# EAGLE design Board_2_sensor_v1 (EAGLE 7.1.0)
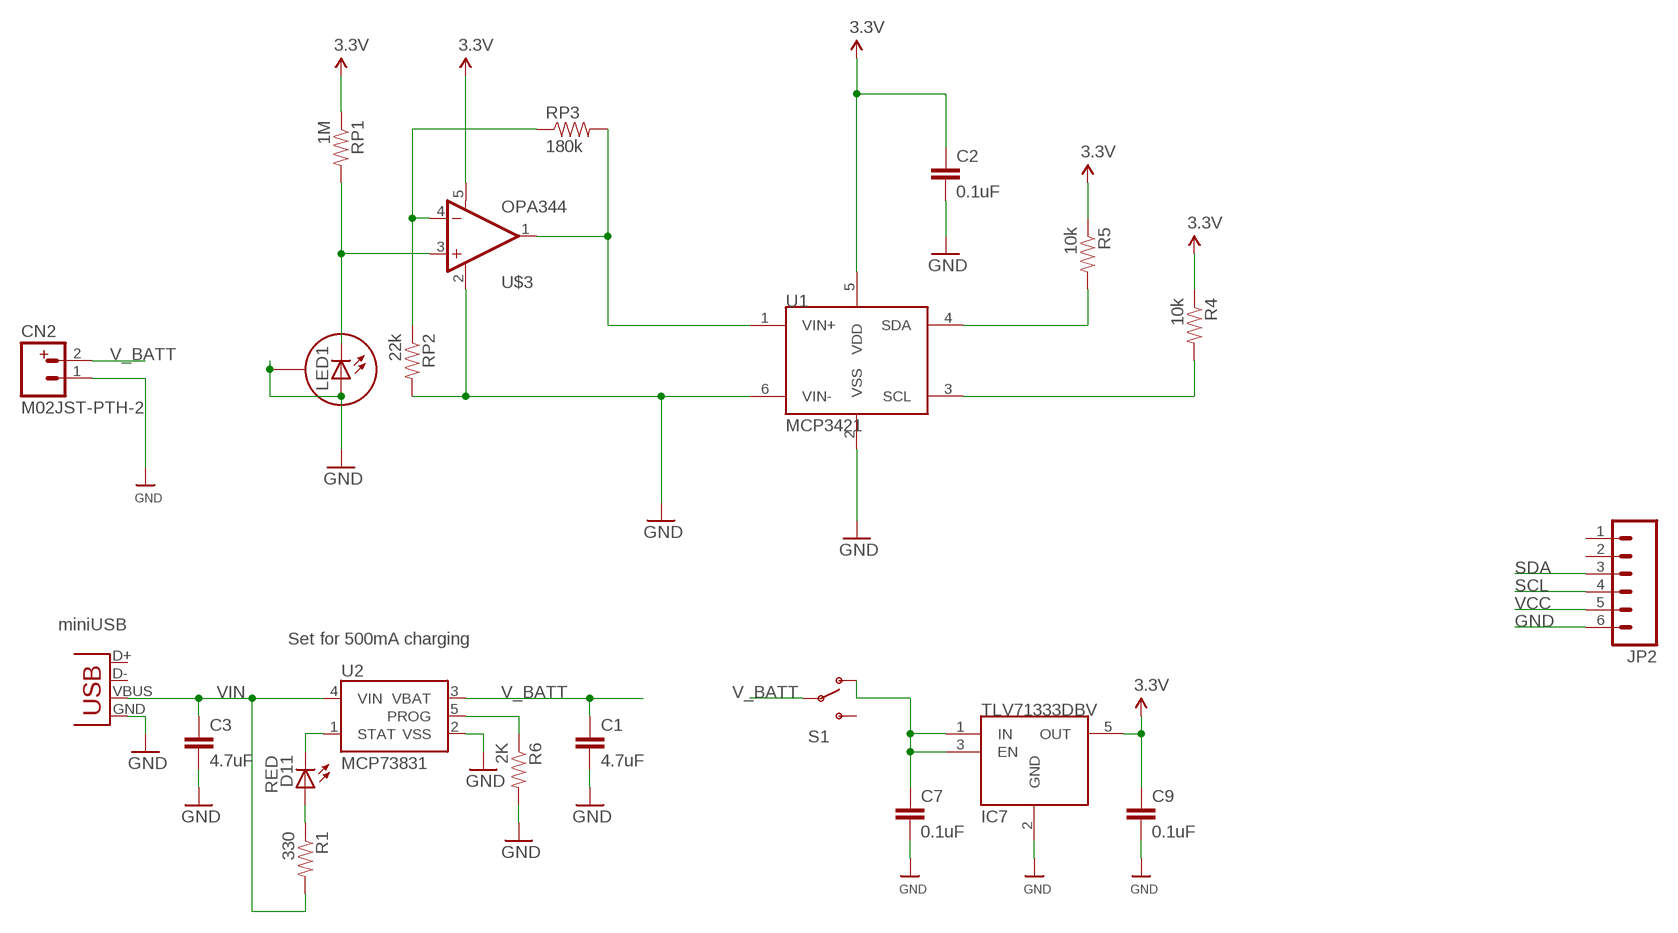
[diagram p0: schematic, sheet 1]

## Parts
C1  4.7uF  CAP0402-CAP  [0402-CAP]
C2  0.1uF  CAP0402-CAP  [0402-CAP]
C3  4.7uF  CAP0402-CAP  [0402-CAP]
C7  0.1uF  C-EUC0402  [C0402]
C9  0.1uF  C-EUC0402  [C0402]
CN2  M02JST-PTH-2  [JST-2-PTH]
D11  RED  LED0603  [LED-0603]
IC7  TLV71333DBV  [SOT-23-5]
JP2  M06SMD-1MM  [1X06-1MM]
LED1  MTPD1346  [TO-46]
R1  330  RESISTOR0402-RES  [0402-RES]
R4  10k  RESISTOR0402-RES  [0402-RES]
R5  10k  RESISTOR0402-RES  [0402-RES]
R6  2K  RESISTOR0402-RES  [0402-RES]
RP1  1M  RESISTOR0402-RES  [0402-RES]
RP2  22k  RESISTOR0402-RES  [0402-RES]
RP3  180k  RESISTOR0402-RES  [0402-RES]
S1  SWITCH-SPDTSMD  [AYZ0202]
U1  MCP3421  [SOT-23-6]
U2  MCP73831  [SOT23-5]
U$3  OPA344  [SOT23-5]
X1  Micro USB  USB-MICROB  [USB-MICROB]

## Nets
GND: C1.2 C2.2 C3.2 C7.2 C9.2 CN2.1 IC7.2(GND) JP2.6 LED1.C LED1.CASE R6.2 RP2.2 U1.2(VSS) U1.6(VIN-) U2.2(VSS) U$3.2(V-) X1.GND
N$2: LED1.A RP1.2 U$3.3(+IN)
N$3: RP2.1 RP3.1 U$3.4(-IN)
N$4: RP3.2 U1.1(VIN+) U$3.1(OUT)
N$6: C7.1 IC7.1(IN) IC7.3(EN) S1.1(O)
N$13: D11.A R1.1
PROG: R6.1 U2.5(PROG)
SCL: JP2.4 R4.2 U1.3(SCL)
SDA: JP2.3 R5.2 U1.4(SDA)
STAT: D11.C U2.1(STAT)
V_BATT: C1.1 CN2.2 S1.2(P) U2.3(VBAT)
VCC: C2.1 C9.1 IC7.5(OUT) JP2.5 R4.1 R5.1 RP1.1 U1.5(VDD) U$3.5(V+) ; supply symbol labelled 3.3V
VIN: C3.1 R1.2 U2.4(VIN) X1.VBUS
Unconnected: JP2.1 JP2.2 S1.3(S) X1.D+ X1.D-

## Notes on the sheet
- miniUSB
- Set for 500mA charging

## Library data of the parts
C1-C3 = SparkFun:CAP: Capacitor Standard 0603 ceramic capacitor, and 0.1" leaded capacitor.
C7 C9 = rcl:C-EU: CAPACITOR, European symbol
CN2 = SparkFun-Connectors:M02: Standard 2-pin 0.1" header. Use with - straight break away headers ( PRT-00116) - right angle break away headers (PRT-00553) - swiss pins (PRT-00743) - machine pins (PRT-00117) - female headers (PRT-00115) Molex polarized connector foot print use with: PRT-08233 with associated crimp pins and housings. 2.54_SCREWTERM for use with PRT-10571. 3.5mm Screw Terminal footprints for PRT-08084 5mm Screw Terminal footprints for use with PRT-08433
D11 = SparkFun:LED: LEDs Standard schematic elements and footprints for 5mm, 3mm, 1206, and 0603 sized LEDs. 5mm - Spark Fun Electronics SKU : COM-00529 (and others)
IC7 = anoven:TLV713: Capacitor-Free, 150-mA, Low-Dropout Regulator with Foldback Current Limit for Portable Devices
JP2 = SparkFun-Connectors:M06: Header 6 Standard 6-pin 0.1" header. Use with straight break away headers (SKU : PRT-00116), right angle break away headers (PRT-00553), swiss pins (PRT-00743), machine pins (PRT-00117), and female headers (PRT-00115). Molex polarized connector foot print use with SKU : PRT-08094 with associated crimp pins and housings. NOTES ON THE VARIANTS LOCK and LOCK_LONGPADS... This footprint was designed to help hold the alignment of a through-hole component (i.e. 6-pin header) while soldering it into place. You may notice that each hole has been shifted either up or down by 0.005 of an inch from it's more standard position (which is a perfectly straight line). This slight alteration caused the pins (the squares in the middle) to touch the edges of the holes. Because they are alternating, it causes a "brace" to hold the component in place. 0.005 has proven to be the perfect amount of "off-center" position when using our standard breakaway headers. Although looks a little odd when you look at the bare footprint, once you have a header in there, the alteration is very hard to notice. Also,if you push a header all the way into place, it is covered up entirely on the bottom side. This idea of altering the position of holes to aid alignment will be further integrated into the Sparkfun Library for other footprints. It can help hold any component with 3 or more connection pins.
LED1 = IdleHandsProject:MTPD1346: LEDs Standard schematic elements and footprints for 5mm, 3mm, 1206, and 0603 sized LEDs. 5mm - Spark Fun Electronics SKU : COM-00529 (and others)
R1 R4-R6 RP1-RP3 = SparkFun:RESISTOR: Resistor Basic schematic elements and footprints for 0603, 1206, and PTH resistors.
S1 = SparkFun-Electromechanical:SWITCH-SPDT: SPDT Switch Simple slide switch, Spark Fun Electronics SKU : COM-00102 DPDT SMT slide switch, AYZ0202, SWCH-08179; PROD_ID: SWCH-08179
U1 = IdleHandsProject:MCP3421: 18-Bit Analog-to-Digital Converter with I2 C Interface and On-Board Reference http://ww1.microchip.com/downloads/en/DeviceDoc/22003e.pdf http://www.digikey.ca/product-detail/en/MCP3421A0T-E%2FCH/MCP3421A0T-E%2FCHCT-ND/2183406
U2 = SparkFun:MCP73831: Microchip's MCP73831 Miniature single cell, fully integrated Li-Ion, Li-polymer charge management controller http://ww1.microchip.com/downloads/en/DeviceDoc/21984a.pdf
U$3 = SparkFun-AnalogIC:OPA344: Single gate rail-to-rail output op-amp. Inputs extend 300mV past rails.
X1 = SparkFun:USB: USB Connectors USB-B-PTH is fully proven SKU : PRT-00139 USB-miniB is fully proven SKU : PRT-00587 USB-A-PCB is untested. USB-A-H is throughly reviewed, but untested. Spark Fun Electronics SKU : PRT-00437 USB-B-SMT is throughly reviewed, but untested. Needs silkscreen touching up. USB-A-S has not been used/tested USB-MB-H has not been used/tested

## Net classes
1 vcc: width 0.254 mm

## Board
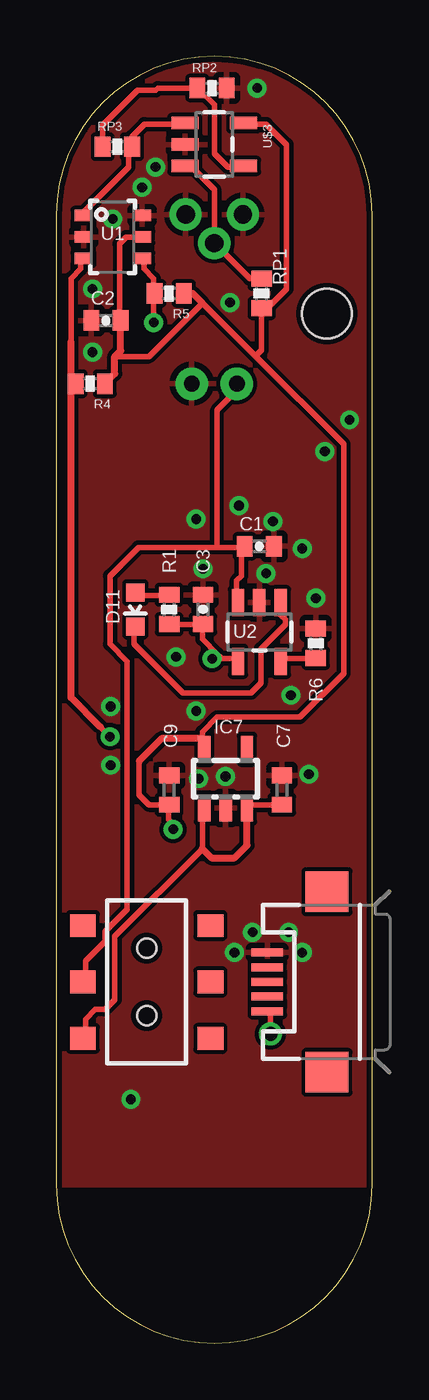
[diagram p1: board, top side]
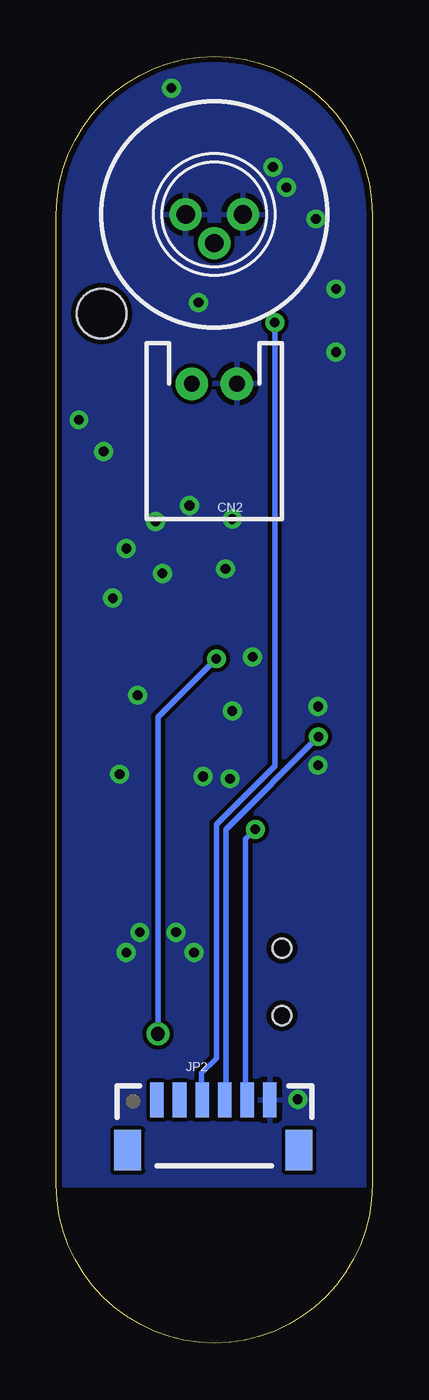
[diagram p2: board, bottom side, seen from below]

Size 14 x 57 mm. Coordinates in mm from the lower left corner, seen from the top.
Outline: 0,7 arc180 14,7 14,50 arc180 0,50 0,7
Copper layers (1*16): Top 0.035mm / dielectric 1.5mm / Bottom 0.035mm
Design rules "default *": minimum track width 10mil, minimum drill 17mil, track to track 7mil, track to pad 7mil, pad to pad 7mil, via to via 7mil, smd to smd 7mil, copper to edge 10mil, drill to drill 8mil, minimum pad ring 10mil, minimum via ring 8mil, stop-mask expansion 4mil, vias tented up to drill 0mil, thermal gap 10mil
Holes 2.2 mm at 12,45.6

### Footprints (pad centres in the part's own frame; a part is rotated, then mirrored left to right if it is on the bottom)
0402-CAP = smd 0.7 x 0.9: 1 -0.65,0; 2 0.65,0
C0402 = smd 0.7 x 0.9: 1 -0.65,0; 2 0.65,0
JST-2-PTH = drill 0.7 pad 1.448: 1 -1,0; 2 1,0
LED-0603 = smd 0.8 x 0.8: A 0,-0.75; C 0,0.75
SOT-23-5 = smd 0.55 x 1.2: 1 -0.95,-1.3; 2 0,-1.3; 3 0.95,-1.3; 4 0.95,1.3; 5 -0.95,1.3
1X06-1MM = smd 0.6 x 1.55: 1 -2.54,1.27; 2 -1.54,1.27; 3 -0.54,1.27; 4 0.46,1.27; 5 1.46,1.27; 6 2.46,1.27 | smd 1.2 x 1.8: P$1 -3.84,-0.955; P$2 3.76,-0.955
TO-46 = drill 0.813 pad 1.422: A 0,-1.27; C 1.27,0; CASE -1.27,0
0402-RES = smd 0.7 x 0.9: 1 -0.65,0; 2 0.65,0
AYZ0202 = smd 1 x 1.15: 1 -2.5,2.825; 2 0,2.825; 3 2.5,2.825; 4 -2.5,-2.825; 5 0,-2.825; 6 2.5,-2.825 | hole 0.85: 1.5,0; -1.5,0
SOT-23-6 = smd 0.51 x 0.8: 1 -0.95,-1.3; 2 0,-1.3; 3 0.95,-1.3; 4 0.95,1.3; 5 0,1.3; 6 -0.95,1.3
SOT23-5 = smd 0.55 x 1.2: 1 -0.95,-1.3; 2 0,-1.3; 3 0.95,-1.3; 4 0.95,1.3; 5 -0.95,1.3
USB-MICROB = smd 0.35 x 1.4: D+ 0,2.65; D- -0.65,2.65; GND 1.3,2.65; ID 0.65,2.65; VBUS -1.3,2.65 | smd 1.8 x 1.9: MT1 -4,0; MT2 4,0

### Placement (x,y rotation side)
C1  9,35.3 0 top
C2  2.2,45.3 180 top
C3  6.5,32.5 90 top
C7  10,24.5 90 top
C9  5,24.5 90 top
CN2  7,42.5 180 bottom
D11  3.5,32.5 180 top
IC7  7.5,25 0 top
JP2  7,9.5 0 bottom
LED1  7,50 0 bottom
R1  5,32.5 270 top
R4  1.5,42.5 180 top
R5  5,46.5 180 top
R6  11.5,31 90 top
RP1  9.1,46.5 90 top
RP2  6.9,55.6 0 top
RP3  2.7,53 0 top
S1  4,16 90 top
U1  2.5,49 270 top
U2  9,31.5 180 top
U$3  7,53.1 270 top
X1  12,16 90 top

### Tracks (layer width: path | path; a pad name or v marks a point on that pad's centre or on a via)
GND  (via drill 0.43)
  other vias: 9.6,36.4 10.9,35.2 9.3,34.1 11.5,33 6.5,34.3 8.7,18.2 10.9,17.3 7.9,17.3 7.5,25.1 6.3,25 10.3,18.2 2.4,28.2 2.4,25.6 10.4,28.7 6.2,28 11.2,25.2 3.3,10.8 5.3,30.4 6.2,36.5 8.1,37.1 11.9,39.5 13,40.9 7.7,46.1 1.6,46.7 1.6,43.9 3.8,51.2 2.5,49.8 4.4,52.1 8.9,55.6
  pour Top: 0,7 0,50 arc-180 14,50 14,7
  pour Bottom: 0,7 0,50 arc-180 14,50 14,7
N$2
  Top 0.254: RP1.2 8.58,47.15 LED1.A 7,51.1 5.95,52.15 U$3.3
N$3
  Top 0.254: RP3.1 2.05,53.95 3.6,55.5 4.4,55.5 4.5,55.6 RP2.1 7,54.85 7,52.7 7.6,52.1 8.25,52.1 U$3.4
N$4
  Top 0.254: U1.1 1.2,50.1 3.2,52.1 3.2,52.85 RP3.2 3.35,53.45 3.9,54 5.65,54 U$3.1
N$6
  Top 0.254: C7.1 9.93,23.84 8.64,23.84 IC7.3 8.42,23.62 | S1.1 1.29,13.69 1.29,14.34 1.73,14.77 2.16,14.77 2.59,15.2 2.59,18.01 6.48,21.9 6.48,23.62 IC7.1
  Top 0.305: 6.48,21.9 6.87,21.5 7.9,21.5 8.45,22.05 IC7.3
N$13
  Top 0.254: D11.A 3.67,33.12 4.97,33.12 R1.1
PROG
  Top 0.254: R6.1 11.44,30.32 10.15,30.32 U2.5
SCL  (via drill 0.43)
  Top 0.254: 0.65,44.35 0.65,47.16 1.08,47.59 1.08,48.02 U1.3 | v2.38,26.86 1.94,27.3
  Top 0.305: 1.94,27.3 0.65,28.59 0.65,42.7 | 0.65,44.35 0.65,43 0.65,42.7 | R4.2 0.65,42.7
  Bottom 0.254: v2.38,26.86 6.48,22.76 6.48,10.89 JP2.4
SDA  (via drill 0.43)
  Top 0.254: v4.32,45.21 4.32,46.5 4.32,47.16 3.89,47.59 3.89,48.02 U1.4
  Top 0.305: R5.2 4.32,46.5
  Bottom 0.254: v4.32,45.21 4.32,25.57 6.91,22.98 6.91,12.61 7.56,11.97 7.56,10.89 JP2.3
STAT
  Top 0.254: D11.C 3.45,31.61 3.45,30.96 5.61,28.81 8.64,28.81 9.07,29.24 9.07,30.75 10.15,31.83 10.15,32.04 9.93,32.26 9.93,32.69 U2.1
V_BATT
  Top 0.254: 8.2,35.25 8.2,33.99 7.99,33.77 7.99,32.91 U2.3 | 8.2,35.25 7.12,35.25 | 7.12,35.25 3.64,35.25 2.38,33.99 2.38,30.96 3.14,30.2 3.14,19.21 2.16,18.23 2.16,17.8 1.29,16.93 1.29,16.07 S1.2 | 8.2,35.25 C1.1 | 7.12,35.25 7.12,41.33 7.99,42.19 7.99,42.41 CN2.2
VCC  (via drill 0.43)
  Top 0.254: 2.59,43.7 4.1,43.7 6.48,46.08 8.83,43.73 | 4.97,23.84 4.1,23.84 3.67,24.27 3.67,25.78 | v5.18,22.76 5.18,22.98 4.97,23.19 4.97,23.84 | 4.97,23.84 C9.1 | 8.83,43.73 12.74,39.82 12.74,29.67 10.79,27.73 7.12,27.73 6.48,27.08 6.48,26.8 6.48,26.43 IC7.5 | 8.83,43.73 9.1,44 RP1.1 9.35,45.85 10.2,46.7 10.2,53.1 9.3,54 8.35,54 U$3.5 | U1.5 3.1,49 2.8,48.7 2.8,45.35 C2.1
  Top 0.305: 3.67,25.78 4.69,26.8 6.48,26.8 | R4.1 2.59,42.94 2.59,43.7 2.85,43.96 C2.1 | 6.48,46.08 6.05,46.5 R5.1
  Bottom 0.254: v5.18,22.76 5.61,22.33 5.61,10.89 JP2.5
VIN  (via drill 0.43, 0.61)
  Top 0.254: 6.48,31.83 5.18,31.83 R1.2 | 7.12,30.53 6.48,31.18 6.48,31.83 | 7.12,30.53 7.34,30.32 7.99,30.32 U2.4 | 6.48,31.83 C3.1 | v9.5,13.69 9.5,14.56 X1.VBUS | 7.12,30.53 v6.91,30.32
  Bottom 0.254: v9.5,13.69 9.5,27.73 v6.91,30.32